# EAGLE schematic Analog_Teil (EAGLE 9.3.2)
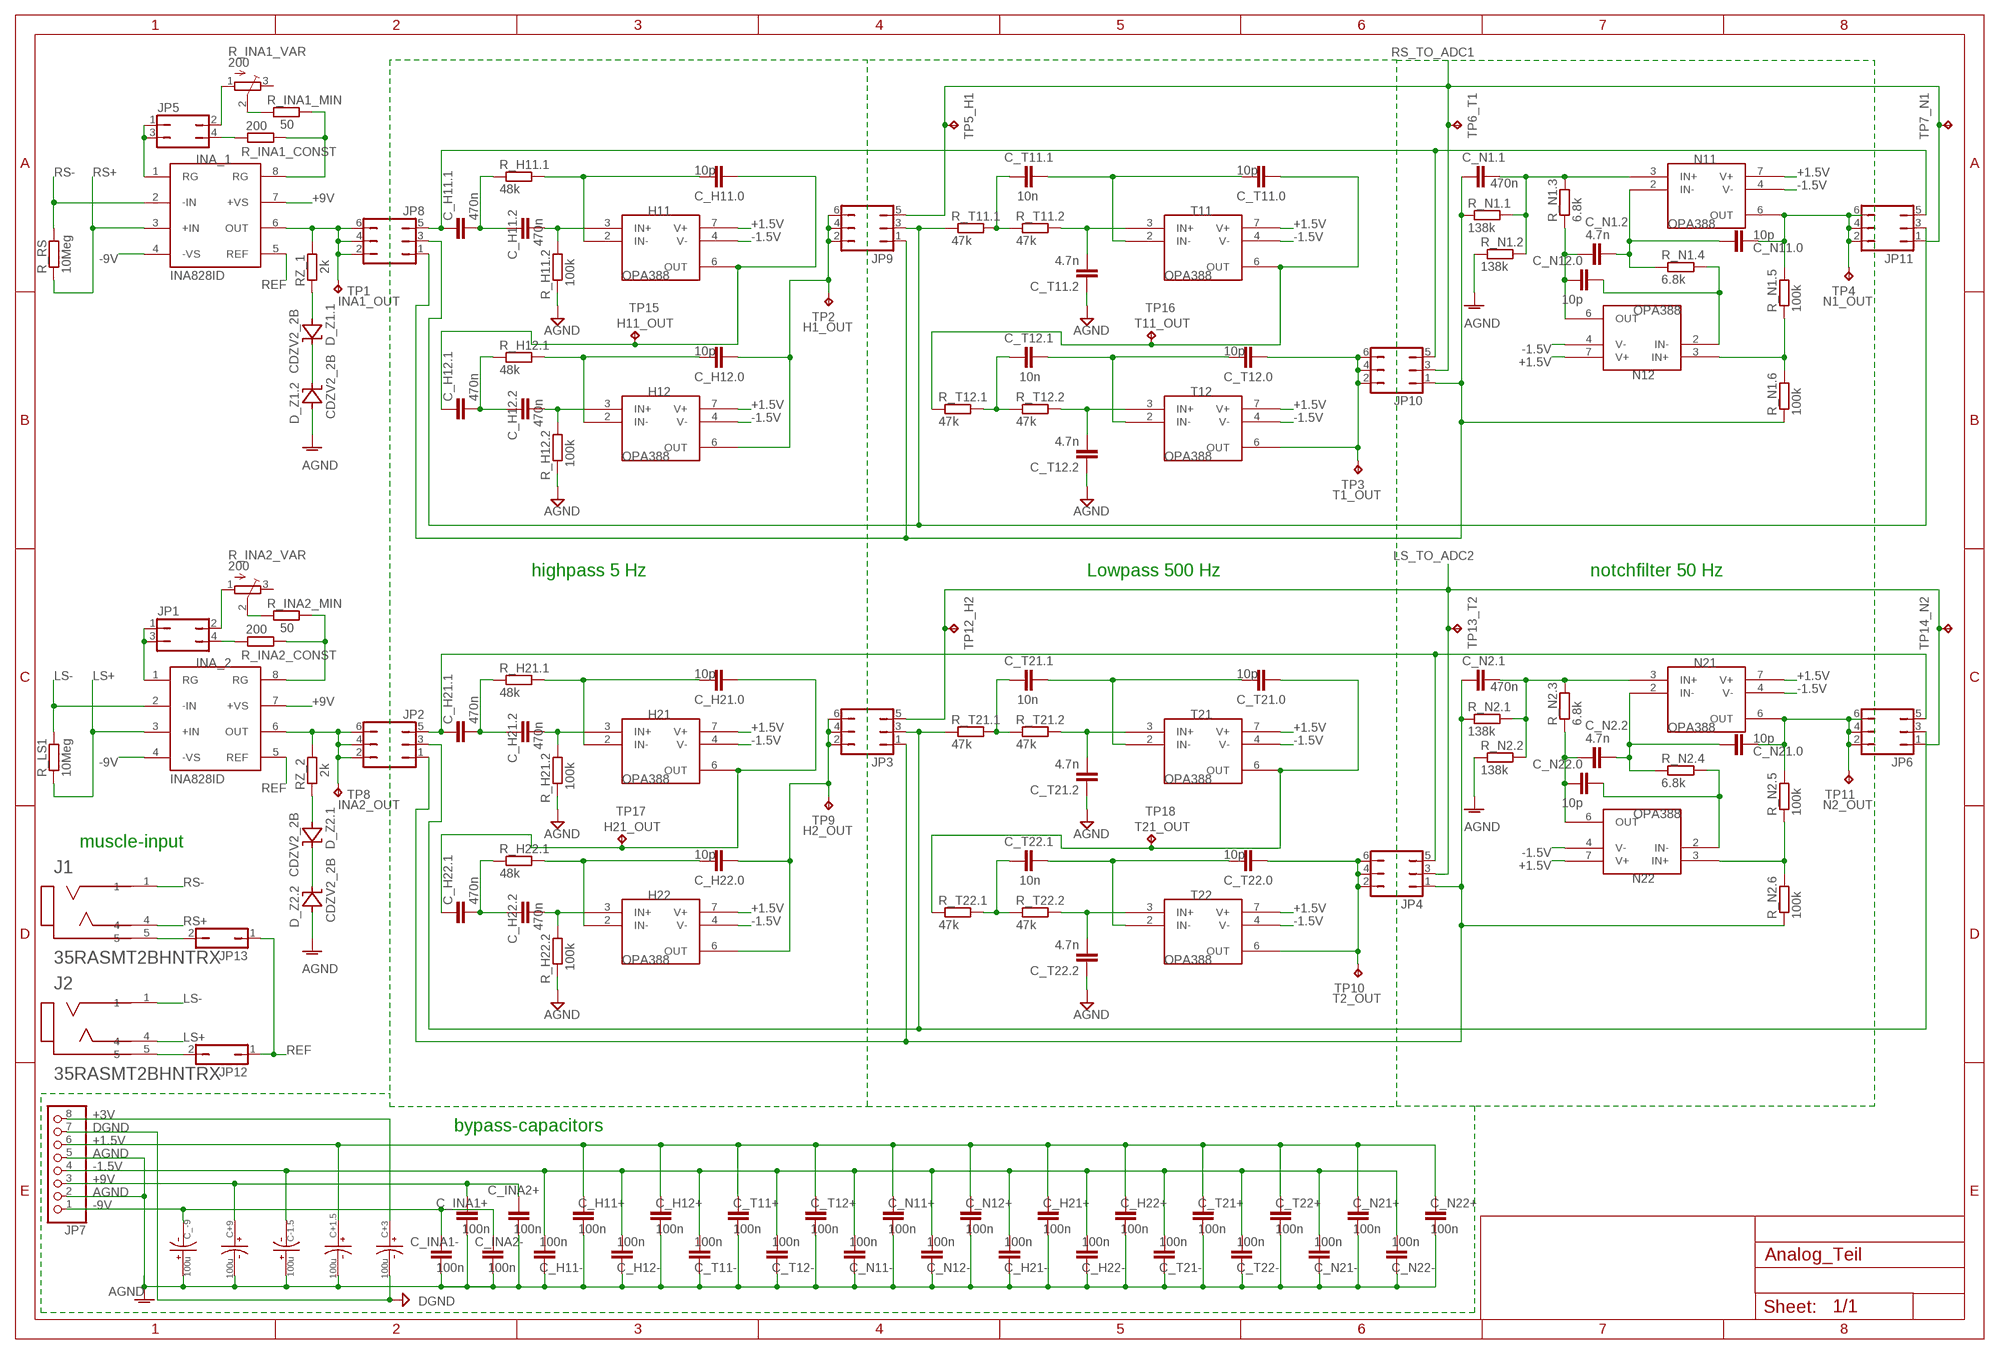
[diagram p0: schematic, sheet 1]

## Parts
C+1.5  100u  ECA-1HM101  [CAPPRD350W60D800H1150B]
C+3  100u  ECA-1HM101  [CAPPRD350W60D800H1150B]
C+9  100u  ECA-1HM101  [CAPPRD350W60D800H1150B]
C-1.5  100u  ECA-1HM101  [CAPPRD350W60D800H1150B]
C_-9  100u  ECA-1HM101  [CAPPRD350W60D800H1150B]
C_H11+  100n  C-EUC0805  [C0805]
C_H11-  100n  C-EUC0805  [C0805]
C_H11.0  10p  C-EUC0805  [C0805]
C_H11.1  470n  C-EUC0805  [C0805]
C_H11.2  470n  C-EUC0805  [C0805]
C_H12+  100n  C-EUC0805  [C0805]
C_H12-  100n  C-EUC0805  [C0805]
C_H12.0  10p  C-EUC0805  [C0805]
C_H12.1  470n  C-EUC0805  [C0805]
C_H12.2  470n  C-EUC0805  [C0805]
C_H21+  100n  C-EUC0805  [C0805]
C_H21-  100n  C-EUC0805  [C0805]
C_H21.0  10p  C-EUC0805  [C0805]
C_H21.1  470n  C-EUC0805  [C0805]
C_H21.2  470n  C-EUC0805  [C0805]
C_H22+  100n  C-EUC0805  [C0805]
C_H22-  100n  C-EUC0805  [C0805]
C_H22.0  10p  C-EUC0805  [C0805]
C_H22.1  470n  C-EUC0805  [C0805]
C_H22.2  470n  C-EUC0805  [C0805]
C_INA1+  100n  C-EUC0805  [C0805]
C_INA1-  100n  C-EUC0805  [C0805]
C_INA2+  100n  C-EUC0805  [C0805]
C_INA2-  100n  C-EUC0805  [C0805]
C_N1.1  470n  C-EUC0805  [C0805]
C_N1.2  4.7n  C-EUC0805  [C0805]
C_N2.1  470n  C-EUC0805  [C0805]
C_N2.2  4.7n  C-EUC0805  [C0805]
C_N11+  100n  C-EUC0805  [C0805]
C_N11-  100n  C-EUC0805  [C0805]
C_N11.0  10p  C-EUC0805  [C0805]
C_N12+  100n  C-EUC0805  [C0805]
C_N12-  100n  C-EUC0805  [C0805]
C_N12.0  10p  C-EUC0805  [C0805]
C_N21+  100n  C-EUC0805  [C0805]
C_N21-  100n  C-EUC0805  [C0805]
C_N21.0  10p  C-EUC0805  [C0805]
C_N22+  100n  C-EUC0805  [C0805]
C_N22-  100n  C-EUC0805  [C0805]
C_N22.0  10p  C-EUC0805  [C0805]
C_T11+  100n  C-EUC0805  [C0805]
C_T11-  100n  C-EUC0805  [C0805]
C_T11.0  10p  C-EUC0805  [C0805]
C_T11.1  10n  C-EUC0805  [C0805]
C_T11.2  4.7n  C-EUC0805  [C0805]
C_T12+  100n  C-EUC0805  [C0805]
C_T12-  100n  C-EUC0805  [C0805]
C_T12.0  10p  C-EUC0805  [C0805]
C_T12.1  10n  C-EUC0805  [C0805]
C_T12.2  4.7n  C-EUC0805  [C0805]
C_T21+  100n  C-EUC0805  [C0805]
C_T21-  100n  C-EUC0805  [C0805]
C_T21.0  10p  C-EUC0805  [C0805]
C_T21.1  10n  C-EUC0805  [C0805]
C_T21.2  4.7n  C-EUC0805  [C0805]
C_T22+  100n  C-EUC0805  [C0805]
C_T22-  100n  C-EUC0805  [C0805]
C_T22.0  10p  C-EUC0805  [C0805]
C_T22.1  10n  C-EUC0805  [C0805]
C_T22.2  4.7n  C-EUC0805  [C0805]
D_Z1.1  CDZV2_2B  CDZV2_2BSOD923  [SODFL1006X40N]
D_Z1.2  CDZV2_2B  CDZV2_2BSOD923  [SODFL1006X40N]
D_Z2.1  CDZV2_2B  CDZV2_2BSOD923  [SODFL1006X40N]
D_Z2.2  CDZV2_2B  CDZV2_2BSOD923  [SODFL1006X40N]
H11  OPA388  [SOIC127P600X175-8N]
H12  OPA388  [SOIC127P600X175-8N]
H21  OPA388  [SOIC127P600X175-8N]
H22  OPA388  [SOIC127P600X175-8N]
INA_1  INA828ID  [SOIC8]
INA_2  INA828ID  [SOIC8]
J1  35RASMT2BHNTRX  [SWITCHCRAFT_35RASMT2BHNTRX]
J2  35RASMT2BHNTRX  [SWITCHCRAFT_35RASMT2BHNTRX]
JP1  JP2Q  [JP2Q]
JP2  JP3Q  [JP3Q]
JP3  JP3Q  [JP3Q]
JP4  JP3Q  [JP3Q]
JP5  JP2Q  [JP2Q]
JP6  JP3Q  [JP3Q]
JP7  PINHD-1X8  [1X08]
JP8  JP3Q  [JP3Q]
JP9  JP3Q  [JP3Q]
JP10  JP3Q  [JP3Q]
JP11  JP3Q  [JP3Q]
JP12  JP1Q  [JP1]
JP13  JP1Q  [JP1]
N11  OPA388  [SOIC127P600X175-8N]
N12  OPA388  [SOIC127P600X175-8N]
N21  OPA388  [SOIC127P600X175-8N]
N22  OPA388  [SOIC127P600X175-8N]
R_H11.1  48k  R-EU_R0805  [R0805]
R_H11.2  100k  R-EU_R0805  [R0805]
R_H12.1  48k  R-EU_R0805  [R0805]
R_H12.2  100k  R-EU_R0805  [R0805]
R_H21.1  48k  R-EU_R0805  [R0805]
R_H21.2  100k  R-EU_R0805  [R0805]
R_H22.1  48k  R-EU_R0805  [R0805]
R_H22.2  100k  R-EU_R0805  [R0805]
R_INA1_CONST  200  R-EU_R0805  [R0805]
R_INA1_MIN  50  R-EU_R0805  [R0805]
R_INA1_VAR  200  TRIM_EU-SM-42/43W  [SM-42/43W]
R_INA2_CONST  200  R-EU_R0805  [R0805]
R_INA2_MIN  50  R-EU_R0805  [R0805]
R_INA2_VAR  200  TRIM_EU-SM-42/43W  [SM-42/43W]
R_LS1  10Meg  R-EU_R0805  [R0805]
R_N1.1  138k  R-EU_R0805  [R0805]
R_N1.2  138k  R-EU_R0805  [R0805]
R_N1.3  6.8k  R-EU_R0805  [R0805]
R_N1.4  6.8k  R-EU_R0805  [R0805]
R_N1.5  100k  R-EU_R0805  [R0805]
R_N1.6  100k  R-EU_R0805  [R0805]
R_N2.1  138k  R-EU_R0805  [R0805]
R_N2.2  138k  R-EU_R0805  [R0805]
R_N2.3  6.8k  R-EU_R0805  [R0805]
R_N2.4  6.8k  R-EU_R0805  [R0805]
R_N2.5  100k  R-EU_R0805  [R0805]
R_N2.6  100k  R-EU_R0805  [R0805]
R_RS  10Meg  R-EU_R0805  [R0805]
R_T11.1  47k  R-EU_R0805  [R0805]
R_T11.2  47k  R-EU_R0805  [R0805]
R_T12.1  47k  R-EU_R0805  [R0805]
R_T12.2  47k  R-EU_R0805  [R0805]
R_T21.1  47k  R-EU_R0805  [R0805]
R_T21.2  47k  R-EU_R0805  [R0805]
R_T22.1  47k  R-EU_R0805  [R0805]
R_T22.2  47k  R-EU_R0805  [R0805]
RZ_1  2k  R-EU_R0805  [R0805]
RZ_2  2k  R-EU_R0805  [R0805]
T11  OPA388  [SOIC127P600X175-8N]
T12  OPA388  [SOIC127P600X175-8N]
T21  OPA388  [SOIC127P600X175-8N]
T22  OPA388  [SOIC127P600X175-8N]
TP1  TPPAD1-13  [P1-13]
TP2  TPPAD1-13  [P1-13]
TP3  TPPAD1-13  [P1-13]
TP4  TPPAD1-13  [P1-13]
TP5_H1  TPPAD1-13  [P1-13]
TP6_T1  TPPAD1-13  [P1-13]
TP7_N1  TPPAD1-13  [P1-13]
TP8  TPPAD1-13  [P1-13]
TP9  TPPAD1-13  [P1-13]
TP10  TPPAD1-13  [P1-13]
TP11  TPPAD1-13  [P1-13]
TP12_H2  TPPAD1-13  [P1-13]
TP13_T2  TPPAD1-13  [P1-13]
TP14_N2  TPPAD1-13  [P1-13]
TP15  TPPAD1-13  [P1-13]
TP16  TPPAD1-13  [P1-13]
TP17  TPPAD1-13  [P1-13]
TP18  TPPAD1-13  [P1-13]

## Nets
+1.5V: C+1.5.+ C_H11+.1 C_H12+.1 C_H21+.1 C_H22+.1 C_N11+.1 C_N12+.1 C_N21+.1 C_N22+.1 C_T11+.1 C_T12+.1 C_T21+.1 C_T22+.1 H11.7(V+) H12.7(V+) H21.7(V+) H22.7(V+) JP7.6 N11.7(V+) N12.7(V+) N21.7(V+) N22.7(V+) T11.7(V+) T12.7(V+) T21.7(V+) T22.7(V+)
+3V: C+3.+ JP7.8
+9V: C+9.+ C_INA1+.1 C_INA2+.1 INA_1.7(+VS) INA_2.7(+VS) JP7.3
-1.5V: C-1.5.- C_H11-.2 C_H12-.2 C_H21-.2 C_H22-.2 C_N11-.2 C_N12-.2 C_N21-.2 C_N22-.2 C_T11-.2 C_T12-.2 C_T21-.2 C_T22-.2 H11.4(V-) H12.4(V-) H21.4(V-) H22.4(V-) JP7.4 N11.4(V-) N12.4(V-) N21.4(V-) N22.4(V-) T11.4(V-) T12.4(V-) T21.4(V-) T22.4(V-)
-9V: C_-9.- C_INA1-.1 C_INA2-.1 INA_1.4(-VS) INA_2.4(-VS) JP7.1
AGND: C+1.5.- C+9.- C-1.5.+ C_-9.+ C_H11+.2 C_H11-.1 C_H12+.2 C_H12-.1 C_H21+.2 C_H21-.1 C_H22+.2 C_H22-.1 C_INA1+.2 C_INA1-.2 C_INA2+.2 C_INA2-.2 C_N11+.2 C_N11-.1 C_N12+.2 C_N12-.1 C_N21+.2 C_N21-.1 C_N22+.2 C_N22-.1 C_T11+.2 C_T11-.1 C_T11.2.1 C_T12+.2 C_T12-.1 C_T12.2.1 C_T21+.2 C_T21-.1 C_T21.2.1 C_T22+.2 C_T22-.1 C_T22.2.1 D_Z1.2.1(A) D_Z2.2.1(A) JP7.2 JP7.5 R_H11.2.1 R_H12.2.1 R_H21.2.1 R_H22.2.1 R_N1.2.1 R_N2.2.1
DGND: C+3.- JP7.7
H1_OUT: C_H12.0.1 H12.6(OUT) JP9.2 JP9.4 JP9.6 TP2.TP
H2_OUT: C_H22.0.1 H22.6(OUT) JP3.2 JP3.4 JP3.6 TP9.TP
H11_OUT: C_H11.0.1 C_H12.1.1 H11.6(OUT) TP15.TP
H21_OUT: C_H21.0.1 C_H22.1.1 H21.6(OUT) TP17.TP
INA1_OUT: INA_1.6(OUT) JP8.2 JP8.4 JP8.6 RZ_1.2 TP1.TP
INA2_OUT: INA_2.6(OUT) JP2.2 JP2.4 JP2.6 RZ_2.2 TP8.TP
LS+: INA_2.3(+IN) J2.4 R_LS1.1
LS-: INA_2.2(-IN) J2.1 R_LS1.2
LS_TO_ADC2: JP3.5 JP4.3 JP6.1 TP12_H2.TP TP13_T2.TP TP14_N2.TP
N1_OUT: C_N11.0.1 JP11.2 JP11.4 JP11.6 N11.6(OUT) R_N1.5.2 TP4.TP
N2_OUT: C_N21.0.1 JP6.2 JP6.4 JP6.6 N21.6(OUT) R_N2.5.2 TP11.TP
N$1: R_INA2_MIN.1 R_INA2_VAR.2(S)
N$3: C_H11.1.2 C_H11.2.1 R_H11.1.1
N$4: C_H11.2.2 H11.3(IN+) R_H11.2.2
N$5: D_Z1.1.1(A) RZ_1.1
N$6: D_Z1.1.2(C) D_Z1.2.2(C)
N$7: C_H12.1.2 C_H12.2.1 R_H12.1.1
N$8: C_H12.2.2 H12.3(IN+) R_H12.2.2
N$9: C_T11.1.1 R_T11.1.2 R_T11.2.1
N$10: C_H11.0.2 H11.2(IN-) R_H11.1.2
N$11: C_T11.2.2 R_T11.2.2 T11.3(IN+)
N$12: C_T12.1.1 R_T12.1.2 R_T12.2.1
N$13: C_H12.0.2 H12.2(IN-) R_H12.1.2
N$14: C_T12.2.2 R_T12.2.2 T12.3(IN+)
N$15: C_T12.0.2 C_T12.1.2 T12.2(IN-)
N$16: JP5.4 R_INA1_CONST.1
N$17: C_N1.1.2 N11.3(IN+) R_N1.1.2 R_N1.2.2 R_N1.3.2
N$18: C_N1.2.1 C_N12.0.2 N12.6(OUT) R_N1.3.1
N$19: C_N1.2.2 C_N11.0.2 N11.2(IN-) R_N1.4.1
N$20: C_N12.0.1 N12.2(IN-) R_N1.4.2
N$21: C_T11.0.2 C_T11.1.2 T11.2(IN-)
N$22: N12.3(IN+) R_N1.5.1 R_N1.6.2
N$24: C_H21.1.2 C_H21.2.1 R_H21.1.1
N$25: C_H21.2.2 H21.3(IN+) R_H21.2.2
N$26: C_H22.1.2 C_H22.2.1 R_H22.1.1
N$27: C_H22.2.2 H22.3(IN+) R_H22.2.2
N$28: C_T21.1.1 R_T21.1.2 R_T21.2.1
N$29: C_T21.2.2 R_T21.2.2 T21.3(IN+)
N$30: C_T22.1.1 R_T22.1.2 R_T22.2.1
N$31: C_T22.2.2 R_T22.2.2 T22.3(IN+)
N$32: C_N2.1.2 N21.3(IN+) R_N2.1.2 R_N2.2.2 R_N2.3.2
N$33: C_N2.2.1 C_N22.0.2 N22.6(OUT) R_N2.3.1
N$34: C_N2.2.2 C_N21.0.2 N21.2(IN-) R_N2.4.1
N$35: C_N22.0.1 N22.2(IN-) R_N2.4.2
N$36: N22.3(IN+) R_N2.5.1 R_N2.6.2
N$37: JP1.4 R_INA2_CONST.1
N$39: JP1.2 R_INA2_VAR.1(A)
N$40: JP5.2 R_INA1_VAR.1(A)
N$41: C_H21.1.1 JP2.5 JP4.5 JP6.5
N$42: C_H11.1.1 JP8.5 JP10.5 JP11.5
N$43: JP2.3 JP3.3 JP6.3 R_T21.1.1
N$44: C_N2.1.1 JP2.1 JP3.1 JP4.1 R_N2.1.1 R_N2.6.1
N$45: JP8.3 JP9.3 JP11.3 R_T11.1.1
N$49: C_N1.1.1 JP8.1 JP9.1 JP10.1 R_N1.1.1 R_N1.6.1
N$50: D_Z2.1.1(A) RZ_2.1
N$51: D_Z2.1.2(C) D_Z2.2.2(C)
N$52: C_H21.0.2 H21.2(IN-) R_H21.1.2
N$54: R_INA1_MIN.1 R_INA1_VAR.2(S)
N$58: C_H22.0.2 H22.2(IN-) R_H22.1.2
N$59: C_T22.0.2 C_T22.1.2 T22.2(IN-)
N$60: C_T21.0.2 C_T21.1.2 T21.2(IN-)
N$61: J2.5 JP12.2
N$62: J1.5 JP13.2
REF: INA_1.5(REF) INA_2.5(REF) JP12.1 JP13.1
RG1+: INA_1.1(RG) JP5.1 JP5.3
RG1-: INA_1.8(RG) R_INA1_CONST.2 R_INA1_MIN.2
RG2+: INA_2.1(RG) JP1.1 JP1.3
RG2-: INA_2.8(RG) R_INA2_CONST.2 R_INA2_MIN.2
RS+: INA_1.3(+IN) J1.4 R_RS.1
RS-: INA_1.2(-IN) J1.1 R_RS.2
RS_TO_ADC1: JP9.5 JP10.3 JP11.1 TP5_H1.TP TP6_T1.TP TP7_N1.TP
T1_OUT: C_T12.0.1 JP10.2 JP10.4 JP10.6 T12.6(OUT) TP3.TP
T2_OUT: C_T22.0.1 JP4.2 JP4.4 JP4.6 T22.6(OUT) TP10.TP
T11_OUT: C_T11.0.1 R_T12.1.1 T11.6(OUT) TP16.TP
T21_OUT: C_T21.0.1 R_T22.1.1 T21.6(OUT) TP18.TP
Unconnected: H11.1(NC1) H11.5(NC2) H11.8(NC3) H12.1(NC1) H12.5(NC2) H12.8(NC3) H21.1(NC1) H21.5(NC2) H21.8(NC3) H22.1(NC1) H22.5(NC2) H22.8(NC3) N11.1(NC1) N11.5(NC2) N11.8(NC3) N12.1(NC1) N12.5(NC2) N12.8(NC3) N21.1(NC1) N21.5(NC2) N21.8(NC3) N22.1(NC1) N22.5(NC2) N22.8(NC3) R_INA1_VAR.3(E) R_INA2_VAR.3(E) T11.1(NC1) T11.5(NC2) T11.8(NC3) T12.1(NC1) T12.5(NC2) T12.8(NC3) T21.1(NC1) T21.5(NC2) T21.8(NC3) T22.1(NC1) T22.5(NC2) T22.8(NC3)

## Notes on the sheet
- highpass 5 Hz | Lowpass 500 Hz | notchfilter 50 Hz
- muscle-input
- bypass-capacitors

## Library data of the parts
C+1.5 C+3 C+9 C-1.5 C_-9 = ECA-1HM101:ECA-1HM101: Cap Aluminum Lytic 100uF 50V 20% (8 X 11.5mm) Radial 3.5mm 250mA 2000h 85Â°C Bulk; AVAILABILITY: Unavailable; DESCRIPTION: Electrolytic capacitor Radial lead 3.5 mm 100 µF 50 V 20 % _Ø x L_ 8 mm x 11.5 mm Panasonic ECA1HM101 1 pc_s_; MF: Panasonic Electronic; MP: ECA1HM101; PACKAGE: Radial Panasonic; PRICE: None
C_H11+ C_H11- C_H11.0 C_H11.1 C_H11.2 C_H12+ C_H12- C_H12.0 C_H12.1 C_H12.2 C_H21+ C_H21- C_H21.0 C_H21.1 C_H21.2 C_H22+ C_H22- C_H22.0 C_H22.1 C_H22.2 C_INA1+ C_INA1- C_INA2+ C_INA2- C_N1.1 C_N1.2 C_N2.1 C_N2.2 C_N11+ C_N11- C_N11.0 C_N12+ C_N12- C_N12.0 C_N21+ C_N21- C_N21.0 C_N22+ C_N22- C_N22.0 C_T11+ C_T11- C_T11.0 C_T11.1 C_T11.2 C_T12+ C_T12- C_T12.0 C_T12.1 C_T12.2 C_T21+ C_T21- C_T21.0 C_T21.1 C_T21.2 C_T22+ C_T22- C_T22.0 C_T22.1 C_T22.2 = rcl:C-EU: CAPACITOR, European symbol; SPICEPREFIX: C
D_Z1.1 D_Z1.2 D_Z2.1 D_Z2.2 = cdzv2_2b:CDZV2_2B
H11 H12 H21 H22 N11 N12 N21 N22 T11 T12 T21 T22 = OPA388:OPA388
INA_1 INA_2 = INA828ID:INA828ID; DESCRIPTION: 50-μV Offset, 7-nV/√Hz Noise, Low-Power, Precision Instrumentation Amplifier 8-SOIC -40 to 125; DIGI-KEY_PART_NUMBER: 296-47415-ND; DIGI-KEY_PURCHASE_URL: https://www.digikey.com/product-detail/en/texas-instruments/INA828ID/296-47415-ND/7695275?utm_source=snapeda&utm_medium=aggregator&utm_campaign=symbol; MF: Texas Instruments; MP: INA828ID; PACKAGE: SOIC-8 Texas Instruments
J1 J2 = Klinke_3pol:35RASMT2BHNTRX: Conn 3.5MM Stereo Jack F 3 POS Solder RA SMD 3 Terminal 1 Port T/R; AVAILABILITY: Unavailable; DESCRIPTION: Conn 3.5MM Stereo Jack F 3 POS Solder RA SMD 3 Terminal 1 Port T/R; MF: Switchcraft; MP: 35RASMT2BHNTRX; PACKAGE: None; PRICE: None
JP1 JP5 = jumper:JP2Q: JUMPER
JP2-JP4 JP6 JP8-JP11 = jumper:JP3Q: JUMPER
JP7 = pinhead:PINHD-1X8: PIN HEADER
JP12 JP13 = jumper:JP1Q: JUMPER
R_H11.1 R_H11.2 R_H12.1 R_H12.2 R_H21.1 R_H21.2 R_H22.1 R_H22.2 R_INA1_CONST R_INA1_MIN R_INA2_CONST R_INA2_MIN R_LS1 R_N1.1-R_N1.6 R_N2.1-R_N2.6 R_RS R_T11.1 R_T11.2 R_T12.1 R_T12.2 R_T21.1 R_T21.2 R_T22.1 R_T22.2 RZ_1 RZ_2 = rcl:R-EU_: RESISTOR, European symbol; SPICEPREFIX: R
R_INA1_VAR R_INA2_VAR = pot:TRIM_EU-: POTENTIOMETER; SPICEPREFIX: J
TP1-TP4 TP5_H1 TP6_T1 TP7_N1 TP8-TP11 TP12_H2 TP13_T2 TP14_N2 TP15-TP18 = testpad:TP: Test pad